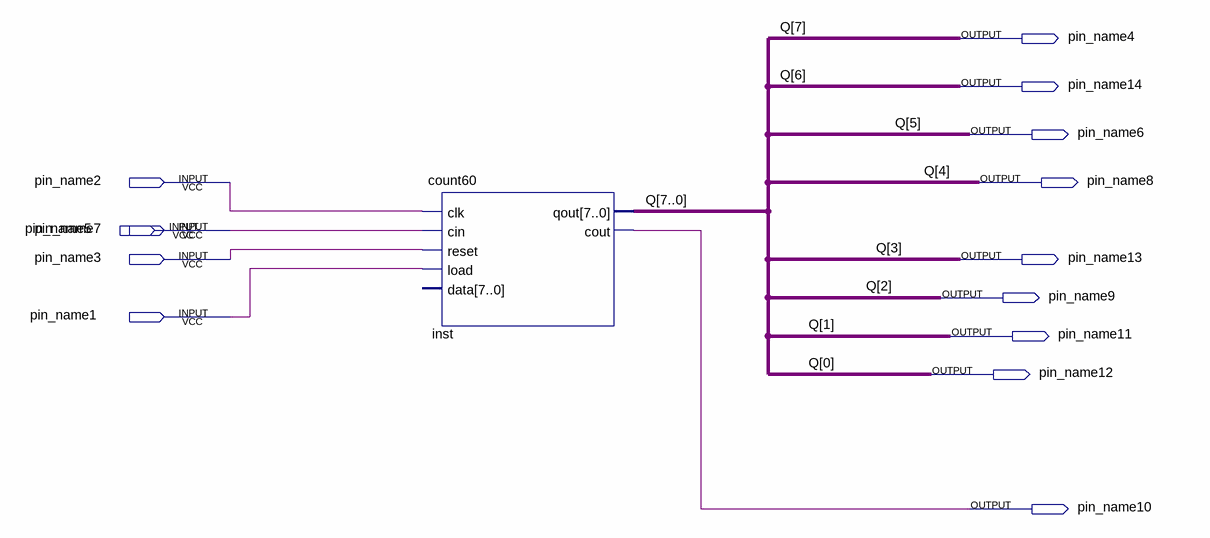
[diagram p0: schematic sheet]
// Quartus schematic Block1.bdf as structural Verilog: 1 symbols, 14 pins
module Block1 (
  input  pin_name2,
  input  pin_name5,
  input  pin_name7,
  input  pin_name3,
  input  pin_name1,
  output pin_name4,
  output pin_name14,
  output pin_name6,
  output pin_name8,
  output pin_name13,
  output pin_name9,
  output pin_name11,
  output pin_name12,
  output pin_name10
);

  count60 inst (
    .clk(pin_name2), .cin(pin_name7), .reset(pin_name3), .load(pin_name1),
    .qout({pin_name4, pin_name14, pin_name6, pin_name8, pin_name13, pin_name9, pin_name11, pin_name12}),
    .cout(pin_name10));  // open: data

  // Other names for the same wires on the sheet: Q[7:0] = {pin_name4, pin_name14, pin_name6, pin_name8, pin_name13, pin_name9, pin_name11, pin_name12}
endmodule
